# EAGLE design GPRSshield V2 (EAGLE 6.5.0)
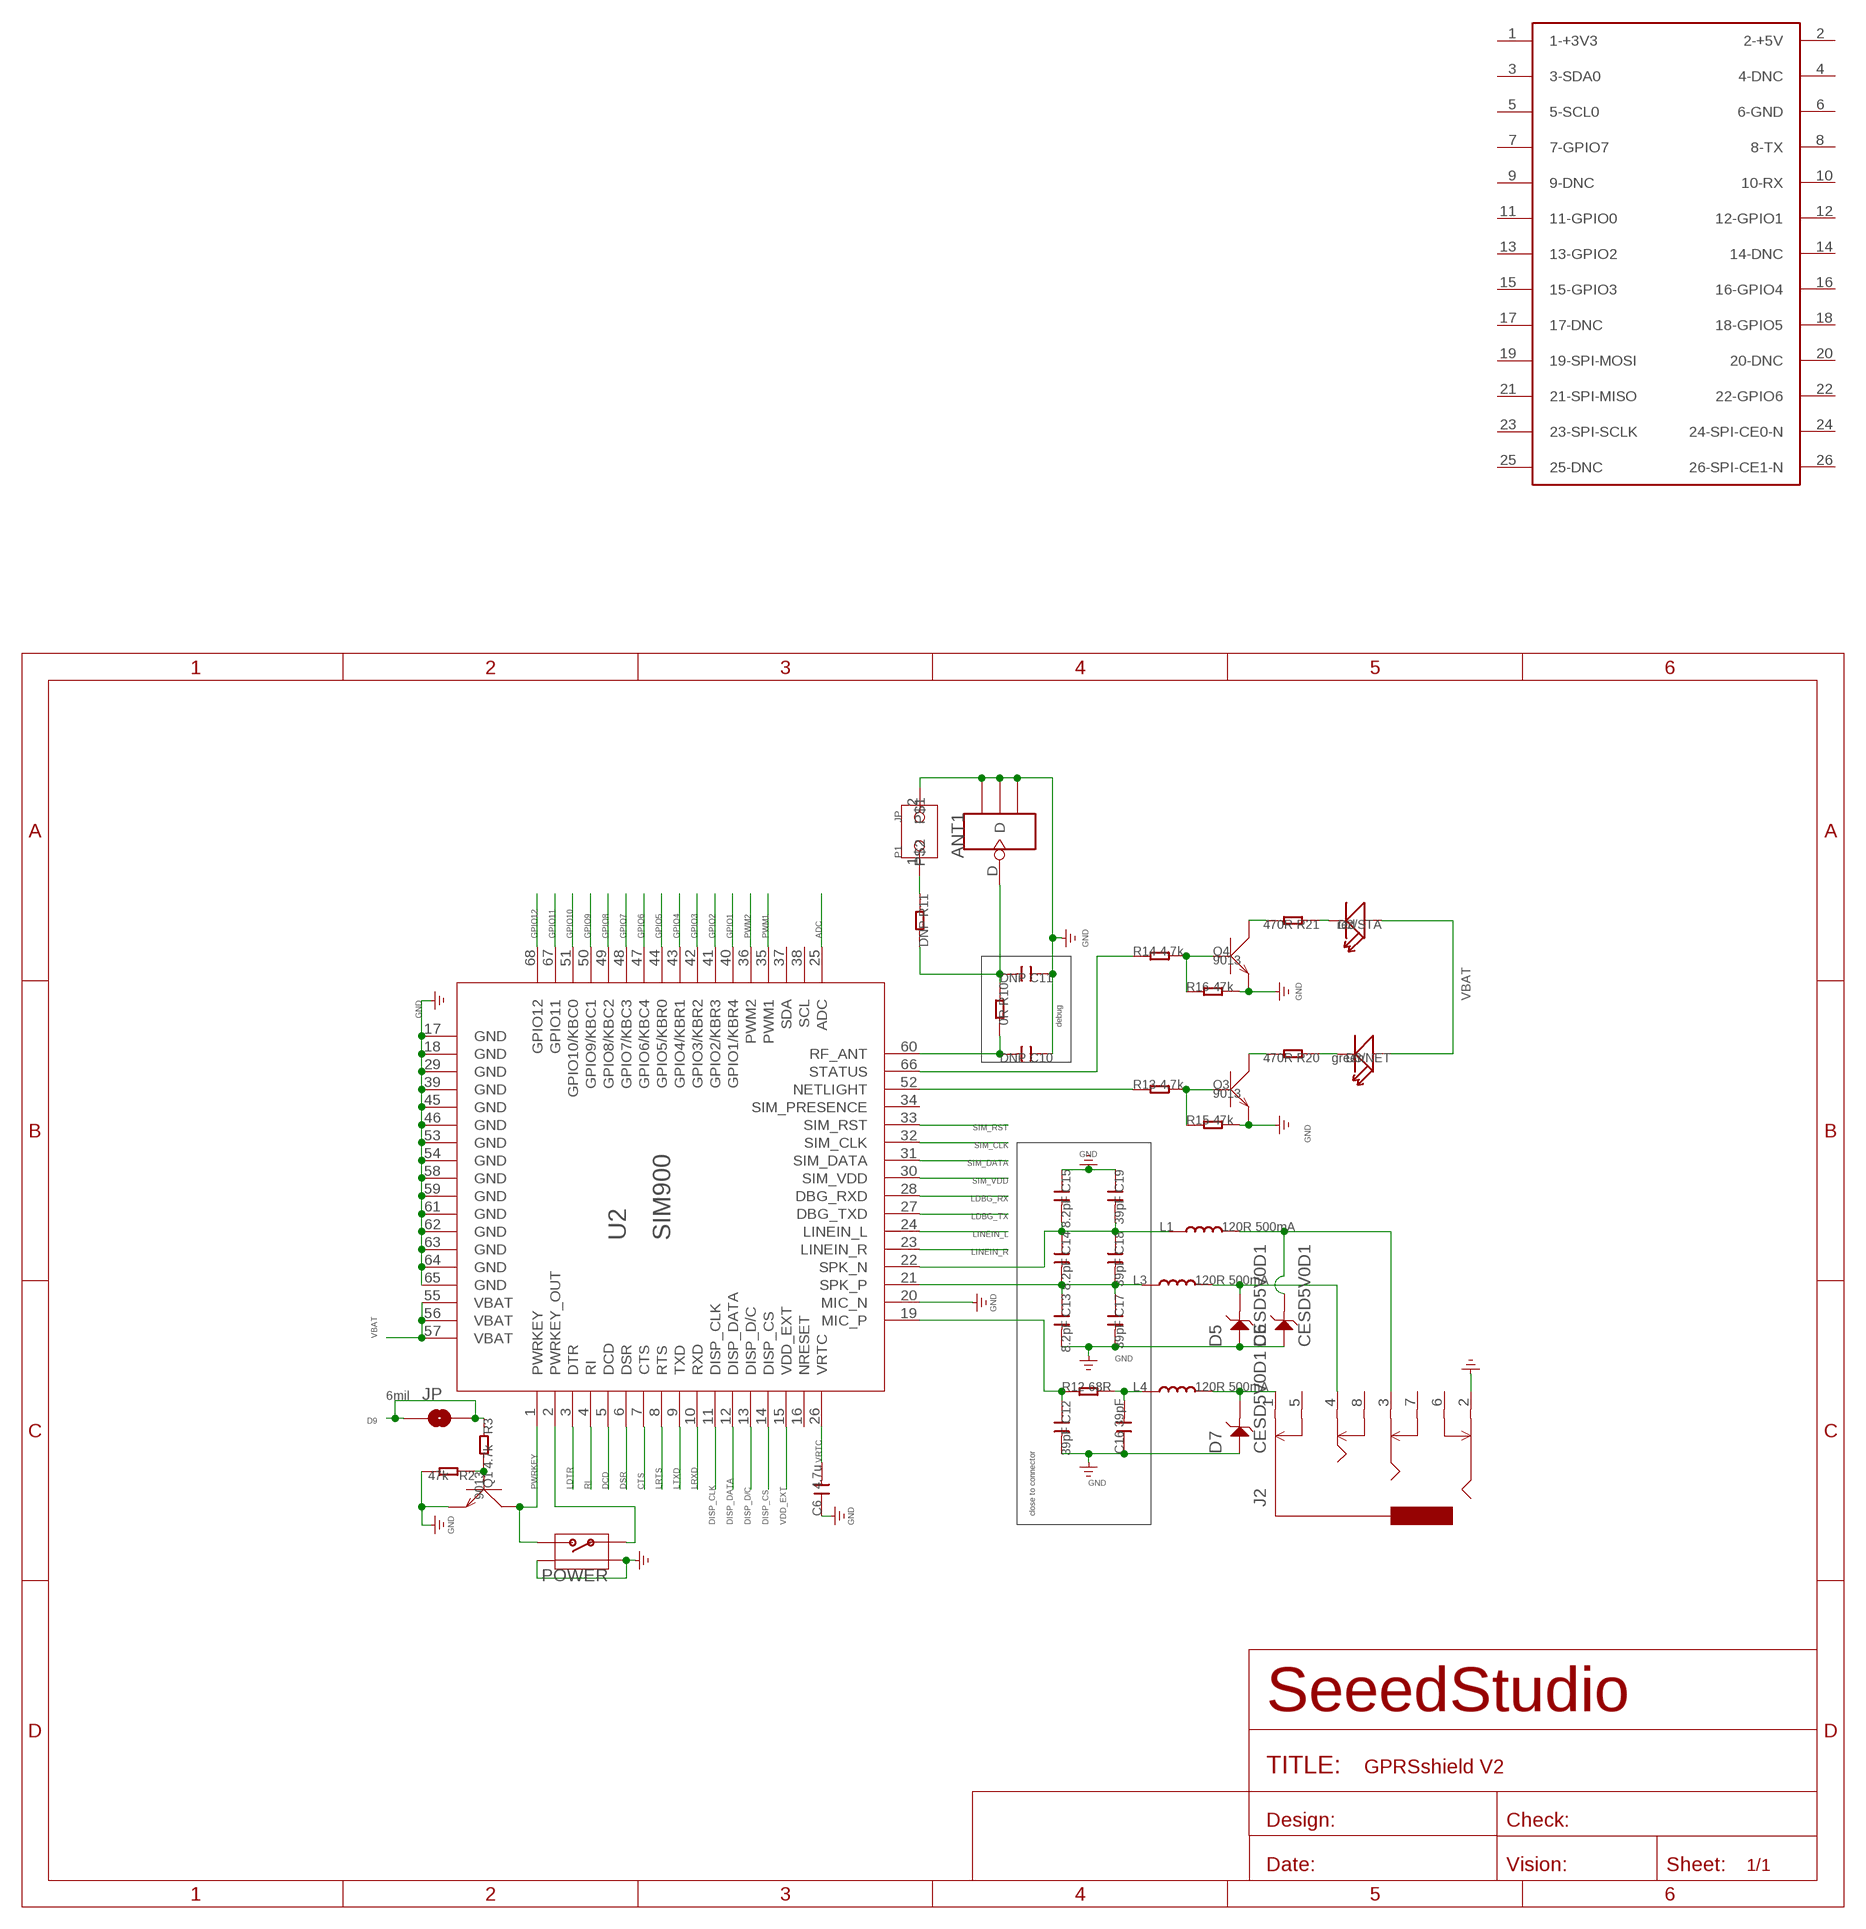
[diagram p0: schematic, sheet 1, part 1 of 2]
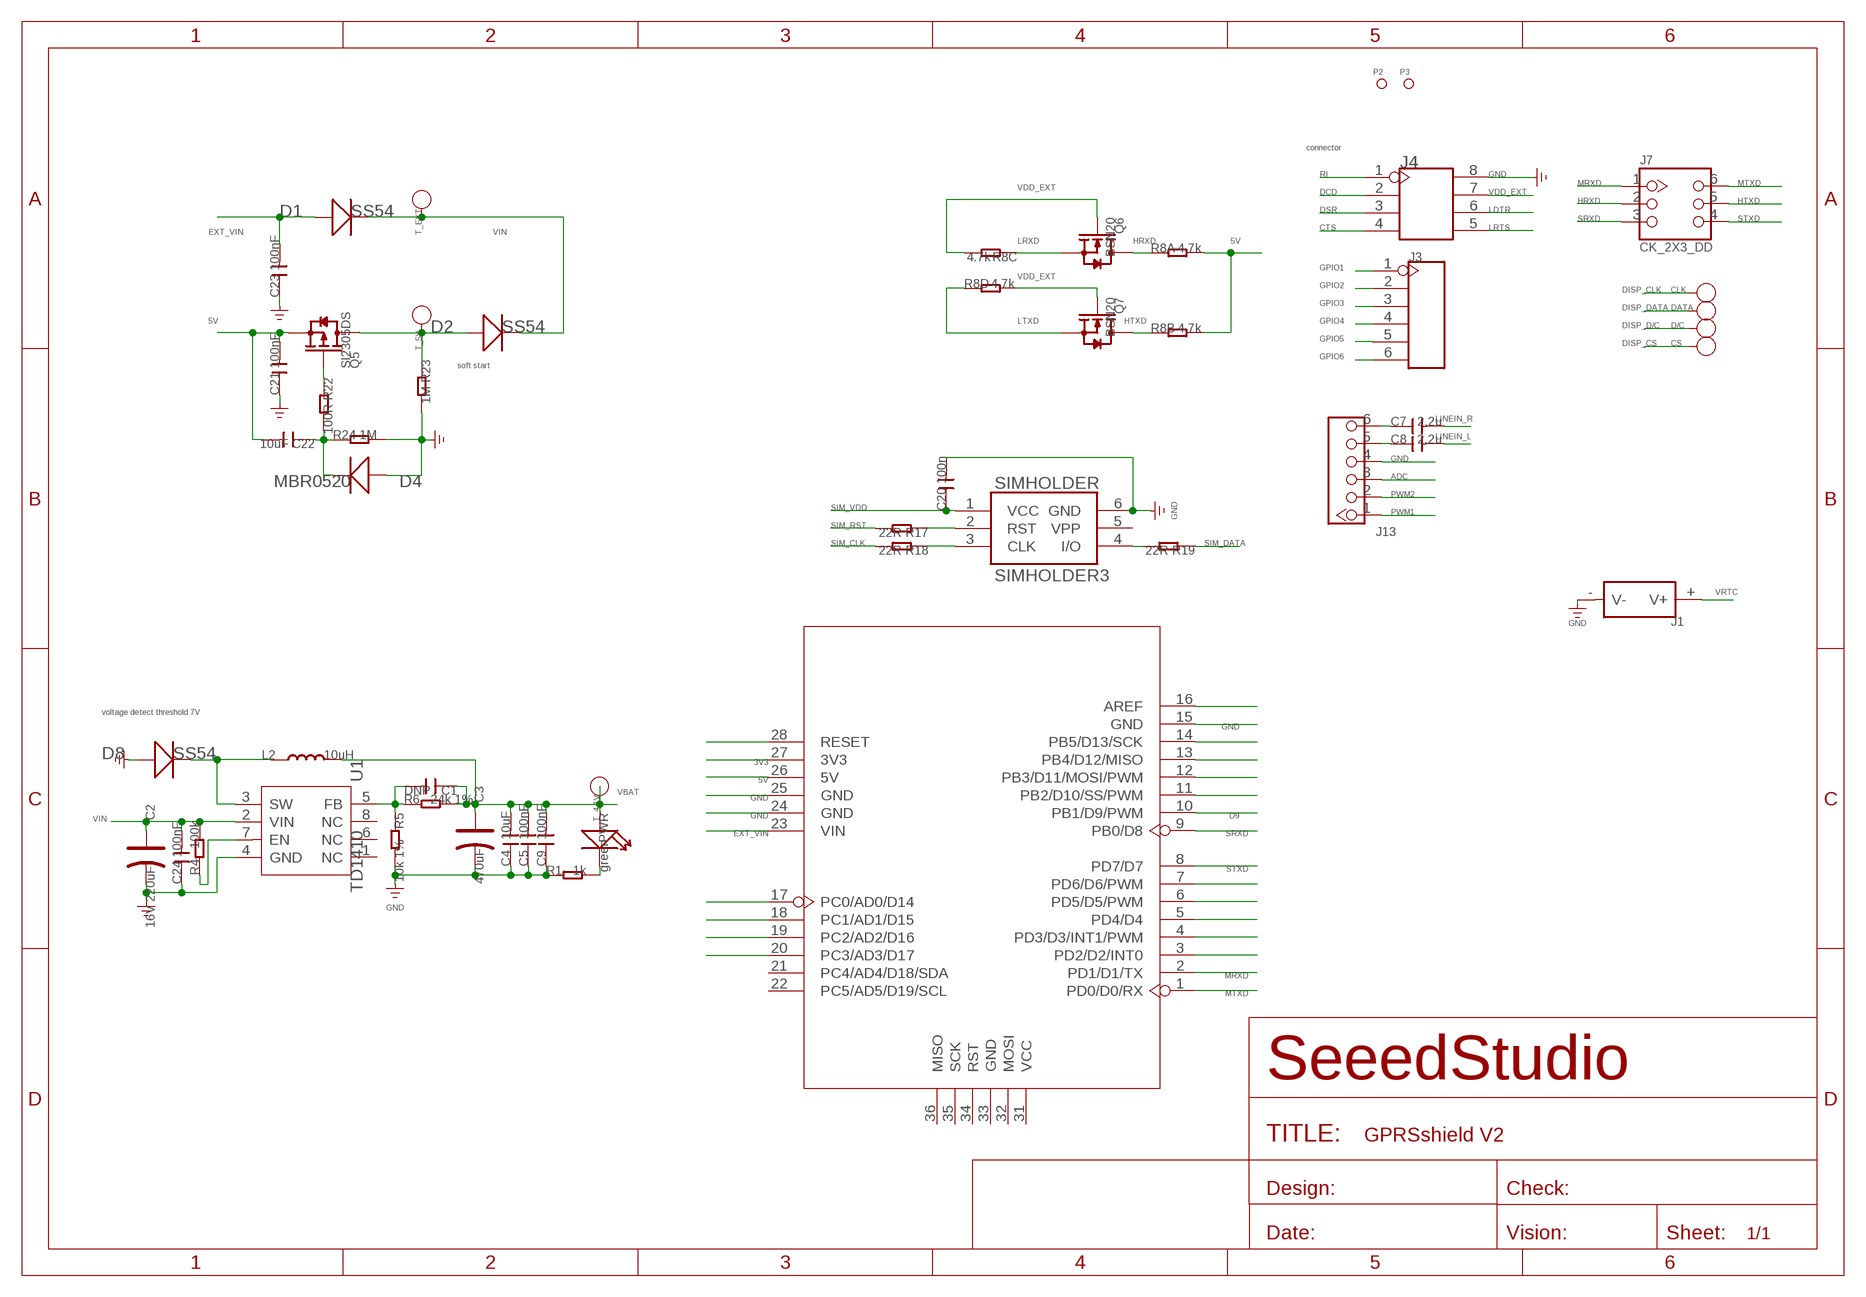
[diagram p1: schematic, sheet 1, part 2 of 2]

## Parts
ANT1  ANTENNA-U-FL  [4P-U-FL]
C1  DNP  C-0603  [C0603]
C2  16V 220uF  CAP-ELECTRO-D  [ELECTRO-SMD-D-5.6MM]
C3  470uF  CAP-AVX-D  [AVX-D]
C4  10uF  C-0805  [C0805]
C5  100nF  C-0603  [C0603]
C6  4.7u  C-0805  [C0805]
C7  2.2u  C-0805  [C0805]
C8  2.2u  C-0805  [C0805]
C9  100nF  C-0603  [C0603]
C10  DNP  C-0603  [C0603]
C11  DNP  C-0603  [C0603]
C12  39pF  C-0603  [C0603]
C13  8.2pF  C-0603  [C0603]
C14  8.2pF  C-0603  [C0603]
C15  8.2pF  C-0603  [C0603]
C16  39pF  C-0603  [C0603]
C17  39pF  C-0603  [C0603]
C18  39pF  C-0603  [C0603]
C19  39pF  C-0603  [C0603]
C20  100n  C-0603  [C0603]
C21  100nF  C-0603  [C0603]
C22  10uF  C-0805  [C0805]
C23  100nF  C-0603  [C0603]
C24  100nF  C-0603  [C0603]
CLK  PAD-TEST-POINT-CIRCLE'4545'  [TP_4545]
CS  PAD-TEST-POINT-CIRCLE'4545'  [TP_4545]
D1  SS54  D'MBRS240LT3'  [SMB]
D2  SS54  D'MBRS240LT3'  [SMB]
D2/STA  red  LED'0603'  [LED-0603]
D3/NET  green  LED'0603'  [LED-0603]
D4  MBR0520  D'MBR0520LT1'  [SOD123-2.7X1.6]
D5  CESD5V0D1  D-ESD  [SOD123-2.7X1.6]
D6  CESD5V0D1  D-ESD  [SOD123-2.7X1.6]
D7  CESD5V0D1  D-ESD  [SOD123-2.7X1.6]
D8  SS54  D'MBRS240LT3'  [SMB]
D/C  PAD-TEST-POINT-CIRCLE'4545'  [TP_4545]
DATA  PAD-TEST-POINT-CIRCLE'4545'  [TP_4545]
J1  HOLDER-BAT  [SMD-CR1220-2]
J2  AUDIO-8P'PJ-3536-L6S'  [8P-3.5-SMD]
J3  HEADER-6P-65/35MIL  [6P-2.54-65/35MIL]
J4  HEADER-2X4P-2.54  [2X4P-2.54]
J7  CK_2X3_DD  [CK_2X3]
J13  HEADER_1X6  [CK_1X6]
JP  PAD-SOLDERJUMPERNC  [2P-SMD-3.3X2]
L1  120R 500mA  L'0603'  [L0603]
L2  10uH  L'0630'  [L0630]
L3  120R 500mA  L'0603'  [L0603]
L4  120R 500mA  L'0603'  [L0603]
P1  JP  [JP]
P2  PAD-MARK  [ROUND-MARK-1.0]
P3  PAD-MARK  [ROUND-MARK-1.0]
POWER  BUTTON-4P-REINFORCE'TS-118E'  [4P-SMD-7X3.5X3.5H]
PWR  green  007-LED0603  [D0603]
Q1  9013  TRANSISTOR-NPN-SOT23  [SOT23]
Q3  9013  TRANSISTOR-NPN-SOT23  [SOT23]
Q4  9013  TRANSISTOR-NPN-SOT23  [SOT23]
Q5  SI2305DS  MOSFET-P'SI2323CDS/SI2305DS<BR>'  [SOT23]
Q6  BSN20  MOSFET-N'SOT23'  [SOT23]
Q7  BSN20  MOSFET-N'SOT23'  [SOT23]
R1  1k  R-0603  [R0603]
R2  47k  R-0603  [R0603]
R3  4.7k  R-0603  [R0603]
R4  100k  R-0603  [R0603]
R5  10k 1%  R-0603  [R0603]
R6  24k 1%  R-0603  [R0603]
R8  4.7k  R-4R-1206  [1206-8-3.3X2.4]
R10  0R  R-0603  [R0603]
R11  DNP  R-0603  [R0603]
R12  68R  R-0603  [R0603]
R13  4.7k  R-0603  [R0603]
R14  4.7k  R-0603  [R0603]
R15  47k  R-0603  [R0603]
R16  47k  R-0603  [R0603]
R17  22R  R-0603  [R0603]
R18  22R  R-0603  [R0603]
R19  22R  R-0603  [R0603]
R20  470R  R-0603  [R0603]
R21  470R  R-0603  [R0603]
R22  100R  R-0603  [R0603]
R23  1M  R-0603  [R0603]
R24  1M  R-0603  [R0603]
SIMHOLDER  SIMHOLDER3  [SIMHOLDER3]
T_4.1V  PAD-TEST-POINT-CIRCLE'4545'  [TP_4545]
T_5V  PAD-TEST-POINT-CIRCLE'4545'  [TP_4545]
T_EXT  PAD-TEST-POINT-CIRCLE'4545'  [TP_4545]
U1  TD1410  [SOP8]
U2  SIM900  [SIM900]
U3  ARDUINO'W/O-SILK'  [ARDUINO-W/O-SILK]
U$4  RASPBERRY-PI  [RASPBERRY-PI]

## Nets
3V3: U3.27(3V3)
5V: C21.2 C22.2 Q5.2(S) R8.7 R8.8 U3.26(5V)
ADC: J13.3 U2.25(ADC)
CTS: J4.4 U2.7(CTS)
D9: JP.1 JP.2 R3.1 U3.10(PB1/D9/PWM)
DCD: J4.2 U2.5(DCD)
DISP_CLK: CLK.T U2.11(DISP_CLK)
DISP_CS: CS.T U2.14(DISP_CS)
DISP_D/C: D/C.T U2.13(DISP_D/C)
DISP_DATA: DATA.T U2.12(DISP_DATA)
DSR: J4.3 U2.6(DSR)
EXT_VIN: C23.2 D1.+ U3.23(VIN)
GND: ANT1.GND1 ANT1.GND2 ANT1.GND3 C2.- C3.- C4.1 C5.1 C6.1 C9.1 C10.1 C11.1 C12.2 C13.2 C15.1 C16.1 C17.2 C19.1 C20.2 C21.1 C23.1 C24.1 D4.1(+) D5.1 D6.1 D7.1 D8.+ J1.-(V-) J2.2 J4.8 J13.4 P1.2 POWER.S1 POWER.S2 Q1.2(E) Q3.2(E) Q4.2(E) R1.1 R2.2 R5.2 R15.2 R16.2 R23.2 R24.2 SIMHOLDER.6(GND) U1.4(GND) U2.17(GND) U2.18(GND) U2.20(MIC_N) U2.29(GND) U2.39(GND) U2.45(GND) U2.46(GND) U2.53(GND) U2.54(GND) U2.58(GND) U2.59(GND) U2.61(GND) U2.62(GND) U2.63(GND) U2.64(GND) U2.65(GND) U3.15(GND) U3.24(GND) U3.25(GND)
GPIO1: J3.1 U2.40(GPIO1/KBR4)
GPIO2: J3.2 U2.41(GPIO2/KBR3)
GPIO3: J3.3 U2.42(GPIO3/KBR2)
GPIO4: J3.4 U2.43(GPIO4/KBR1)
GPIO5: J3.5 U2.44(GPIO5/KBR0)
GPIO6: J3.6 U2.47(GPIO6/KBC4)
GPIO7: U2.48(GPIO7/KBC3)
GPIO8: U2.49(GPIO8/KBC2)
GPIO9: U2.50(GPIO9/KBC1)
GPIO10: U2.51(GPIO10/KBC0)
GPIO11: U2.67(GPIO11)
GPIO12: U2.68(GPIO12)
HRXD: J7.2 Q6.3(D) R8.1
HTXD: J7.5 Q7.3(D) R8.2
LDBG_RX: U2.28(DBG_RXD)
LDBG_TX: U2.27(DBG_TXD)
LDTR: J4.6 U2.3(DTR)
LINEIN_L: C8.2 U2.24(LINEIN_L)
LINEIN_R: C7.2 U2.23(LINEIN_R)
LRTS: J4.5 U2.8(RTS)
LRXD: Q6.2(S) R8.3 U2.10(RXD)
LTXD: Q7.2(S) R8.4 U2.9(TXD)
MRXD: J7.1 U3.2(PD1/D1/TX)
MTXD: J7.6 U3.1(PD0/D0/RX)
N$1: C10.2 R10.2 U2.60(RF_ANT)
N$2: D2.+ Q5.3(D) R23.1 T_5V.T
N$3: Q3.3(C) R20.2
N$4: R19.2 SIMHOLDER.4(I/O)
N$5: R18.1 SIMHOLDER.3(CLK)
N$6: R17.1 SIMHOLDER.2(RST)
N$7: D3/NET.- R20.1
N$8: Q3.1(B) R13.2 R15.1
N$9: PWR.- R1.2
N$10: R13.1 U2.52(NETLIGHT)
N$11: POWER.1 U2.2(PWRKEY_OUT)
N$12: R4.1 U1.7(EN)
N$13: C12.1 R12.1 U2.19(MIC_P)
N$15: C13.1 C14.2 C17.1 C18.2 L3.1 U2.21(SPK_P)
N$16: Q4.3(C) R21.2
N$17: D2/STA.- R21.1
N$18: Q4.1(B) R14.2 R16.1
N$19: C14.1 C15.2 C18.1 C19.2 L1.1 U2.22(SPK_N)
N$20: R14.1 U2.66(STATUS)
N$21: ANT1.D C11.2 R10.1 R11.2
N$23: C7.1 J13.6
N$24: U3.3(PD2/D2/INT0)
N$25: U3.4(PD3/D3/INT1/PWM)
N$26: U3.5(PD4/D4)
N$27: U3.6(PD5/D5/PWM)
N$28: U3.7(PD6/D6/PWM)
N$29: C8.1 J13.5
N$30: C16.2 L4.1 R12.2
N$31: Q5.1(G) R22.1
N$32: U3.11(PB2/D10/SS/PWM)
N$33: U3.12(PB3/D11/MOSI/PWM)
N$34: U3.13(PB4/D12/MISO)
N$35: U3.14(PB5/D13/SCK)
N$36: Q1.1(B) R2.1 R3.2
N$37: U3.16(AREF)
N$38: D8.- L2.1 U1.3(SW)
N$39: C22.1 D4.2(-) R22.2 R24.1
N$41: U3.20(PC3/AD3/D17)
N$42: U3.19(PC2/AD2/D16)
N$43: U3.18(PC1/AD1/D15)
N$44: U3.17(PC0/AD0/D14)
N$45: D7.2 J2.1 L4.2
N$47: C1.2 R5.1 R6.1 U1.5(FB)
N$48: D5.2 J2.4 L3.2
N$50: U3.28(RESET)
N$51: D6.2 J2.3 L1.2
N$52: P1.1 R11.1
PWM1: J13.1 U2.35(PWM1)
PWM2: J13.2 U2.36(PWM2)
PWRKEY: POWER.2 Q1.3(C) U2.1(PWRKEY)
RI: J4.1 U2.4(RI)
SIM_CLK: R18.2 U2.32(SIM_CLK)
SIM_DATA: R19.1 U2.31(SIM_DATA)
SIM_RST: R17.2 U2.33(SIM_RST)
SIM_VDD: C20.1 SIMHOLDER.1(VCC) U2.30(SIM_VDD)
SRXD: J7.3 U3.9(PB0/D8)
STXD: J7.4 U3.8(PD7/D7)
VBAT: C1.1 C3.+ C4.2 C5.2 C9.2 D2/STA.+ D3/NET.+ L2.2 PWR.+ R6.2 T_4.1V.T U2.55(VBAT) U2.56(VBAT) U2.57(VBAT)
VDD_EXT: J4.7 Q6.1(G) Q7.1(G) R8.5 R8.6 U2.15(VDD_EXT)
VIN: C2.+ C24.2 D1.- D2.- R4.2 T_EXT.T U1.2(VIN)
VRTC: C6.2 J1.+(V+) U2.26(VRTC)
Unconnected: J2.5 J2.6 J2.7 J2.8 SIMHOLDER.5(VPP) U1.1(NC) U1.6(NC) U1.8(NC) U2.16(NRESET) U2.34(SIM_PRESENCE) U2.37(SDA) U2.38(SCL) U3.21(PC4/AD4/D18/SDA) U3.22(PC5/AD5/D19/SCL) U3.31(VCC) U3.32(MOSI) U3.33(GND) U3.34(RST) U3.35(SCK) U3.36(MISO) U$4.1(1-+3V3) U$4.2(2-+5V) U$4.3(3-SDA0) U$4.4(4-DNC) U$4.5(5-SCL0) U$4.6(6-GND) U$4.7(7-GPIO7) U$4.8(8-TX) U$4.9(9-DNC) U$4.10(10-RX) U$4.11(11-GPIO0) U$4.12(12-GPIO1) U$4.13(13-GPIO2) U$4.14(14-DNC) U$4.15(15-GPIO3) U$4.16(16-GPIO4) U$4.17(17-DNC) U$4.18(18-GPIO5) U$4.19(19-SPI-MOSI) U$4.20(20-DNC) U$4.21(21-SPI-MISO) U$4.22(22-GPIO6) U$4.23(23-SPI-SCLK) U$4.24(24-SPI-CE0-N) U$4.25(25-DNC) U$4.26(26-SPI-CE1-N)

## Notes on the sheet
- connector
- soft start
- debug
- voltage detect threshold 7V
- 6mil
- close to connector

## Library data of the parts
ANT1 = Connector:ANTENNA-U-FL
C1 C4-C24 = Discrete:C*: Ceramic Capacitors
C2 C3 = Discrete:CAP*: Electrolytic Capacitors,Tantalum Capacitors and Super Capacitors
CLK CS D/C DATA T_4.1V T_5V T_EXT = Discrete:PAD-TEST-POINT-CIRCLE; PARTNO: DNP
D1 D2 D4 D8 = Discrete:D*
D2/STA D3/NET = Discrete:LED*
D5-D7 = template:D-ESD: Diodes for Protectiong against ESD
J1 = Connector:HOLDER-BAT: button cell holder
J2 = template:AUDIO-8P
J3 = Connector:HEADER-6P
J4 = Connector:HEADER-2X4P
J7 = CONNECTER:CK_2X3
J13 = CONNECTER:HEADER_1X6
JP = Discrete:PAD-SOLDERJUMPER: Solder Jumper Standard SMD solder jumper. Used to automate production. Two varients : Normally Open and Normally Closed are the same, but have different paste layers. NC will have a large amount of paste and should jumper during reflow.
L1-L4 = Discrete:L*
P1 = mySeeed:JP
P2 P3 = Discrete:PAD-MARK; PARTNO: DNP
POWER = Discrete:BUTTON-4P-REINFORCE: TS-1188E http://www.best-dz.com/?thread-374-2.html
PWR = Discrete:007-LED*
Q1 Q3 Q4 = Discrete:TRANSISTOR-NPN*: NPN audion
Q5 = Discrete:MOSFET-P
Q6 Q7 = Discrete:MOSFET-N: IRLL014: http://www.vishay.com/docs/91319/sihll014.pdf
R1-R6 R10-R24 = Discrete:R*
R8 = Discrete:R-4R*: Resistor Array
SIMHOLDER = SparkFun2:SIMHOLDER3
U1 = template:TD1410: 2A 380KHz 20V PWM Buck DC/DC Converter
U2 = ICs_v54:SIM900
U3 = moudle:ARDUINO
U$4 = RaspberryPi:RASPBERRY-PI: Raspberry Pi Board <http://www.raspberrypi.org/> Jacques Lagnel V1.0 (beta) 2012 Board dimension: Forum 3D model <http://www.raspberrypi.org/forum/general-discussion/mechanical-profile-3d-models?value=3d%20model&type=1&include=1&search=1&ret=all> The GPIO Connector (P1): http://elinux.org/RPi_Low-level_peripherals

## Net classes
0 default: clearance 0.152 mm

## Board
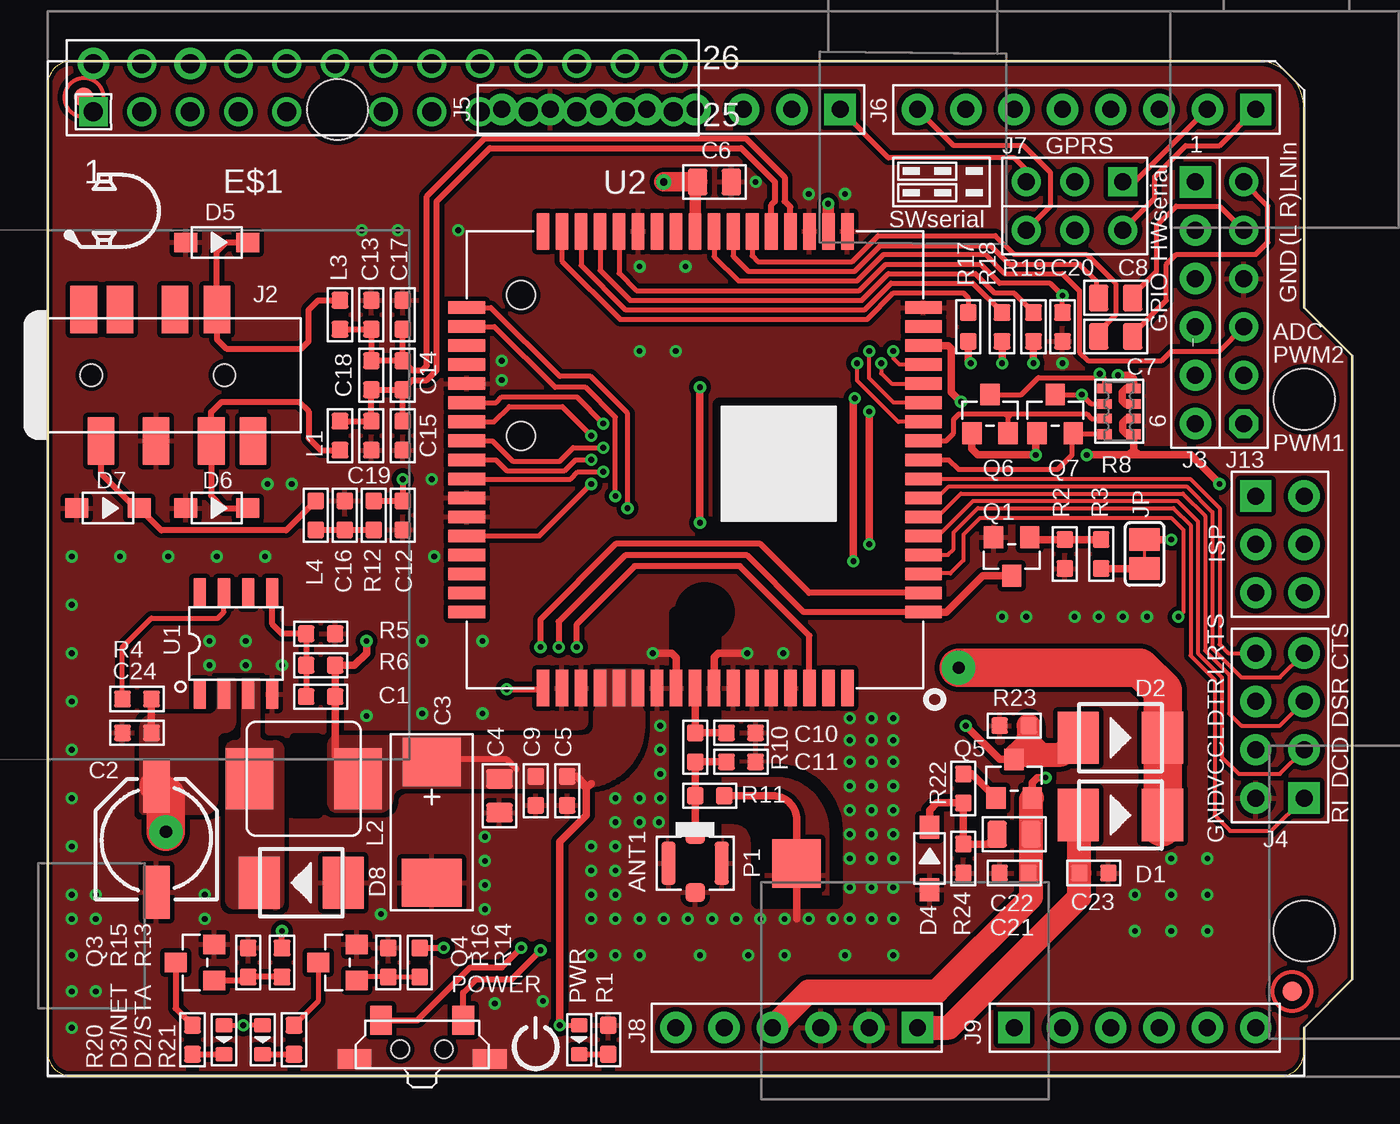
[diagram p2: board, top side]
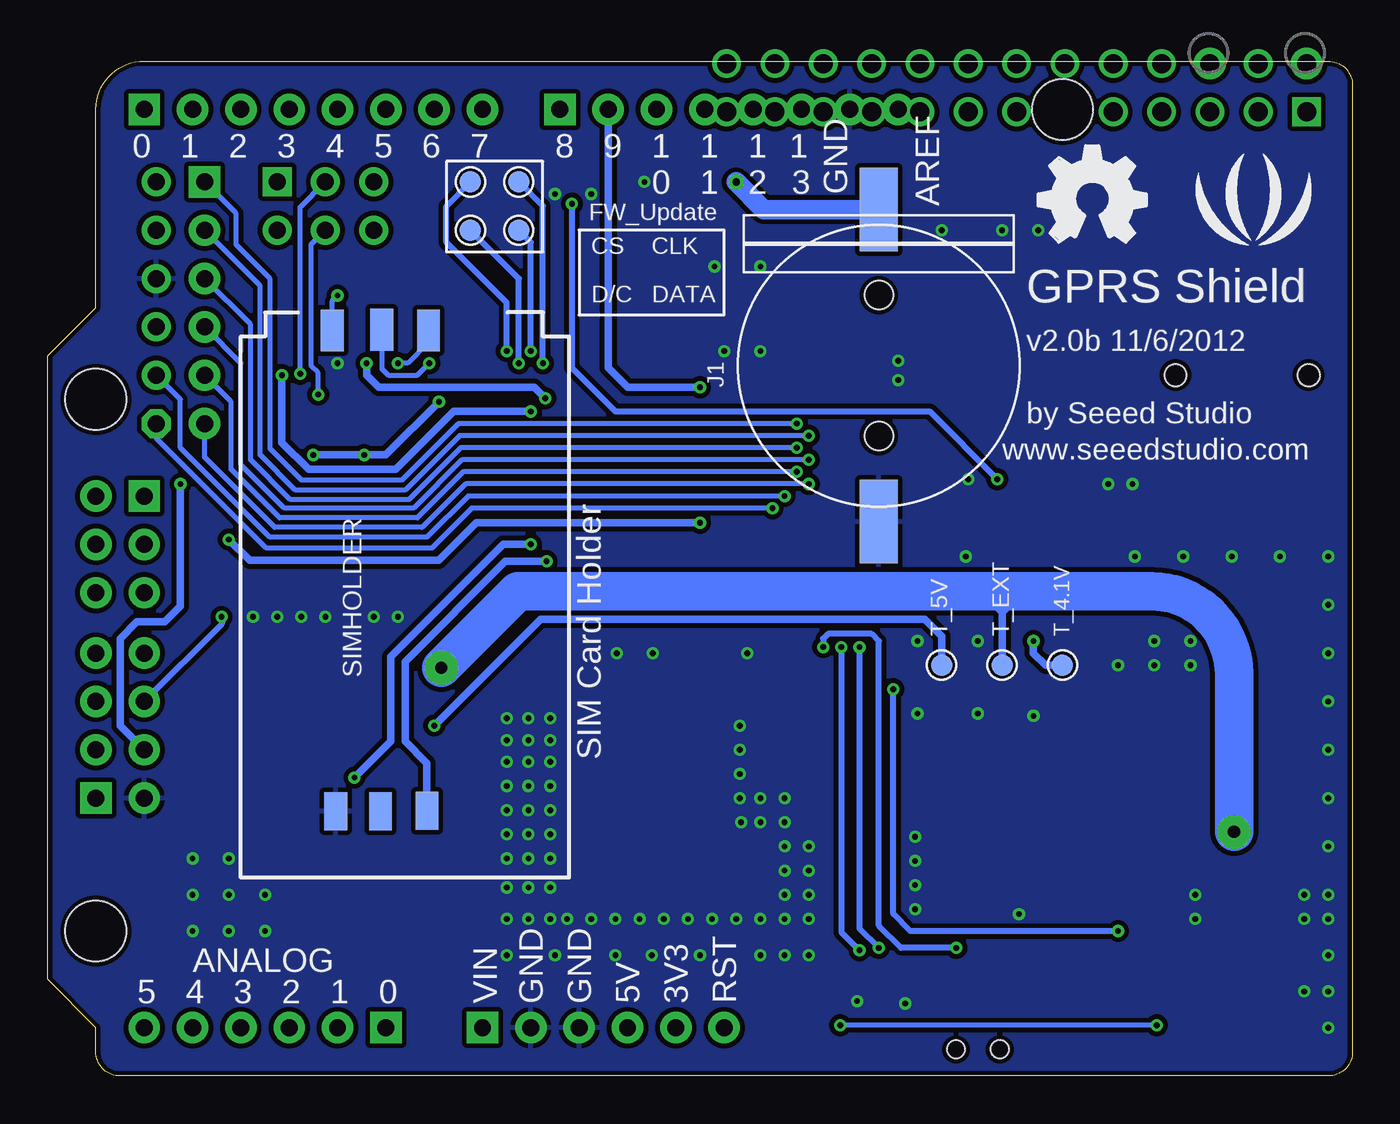
[diagram p3: board, bottom side, seen from below]

Size 68.58 x 53.34 mm. Coordinates in mm from the lower left corner, seen from the top.
Outline: 66.04,40.39 66.04,50.8 arc90 63.5,53.34 1.27,53.34 arc90 0,52.07 0,1.27 arc90 1.27,0 64.77,0 arc90 66.04,1.27 66.04,2.54 68.58,5.08 68.58,37.85 66.04,40.39
Copper layers (1*16): Top 0.035mm / dielectric 1.5mm / Bottom 0.035mm
Design rules "default *": minimum track width 6mil, minimum drill 12mil, track to track 6mil, track to pad 6mil, pad to pad 6mil, via to via 6mil, smd to smd 0mil, copper to edge 10mil, drill to drill 10mil, minimum pad ring 10mil, minimum via ring 6mil, stop-mask expansion 2mil, vias tented up to drill 100mil, thermal gap 10mil
tRestrict: area -14,-47.5 to -13.7,-47.4; area 13,13.8 to 14.2,17.8; area 36.4,20.1 to 36.6,20.8; area 37.5,20 to 37.6,20.8; area 38.5,20.1 to 38.6,20.8; area 27.5,19.9 to 27.6,20.7; area 21.7,29.8 to 22.4,30; 15 lines

### Footprints (pad centres in the part's own frame; a part is rotated, then mirrored left to right if it is on the bottom)
4P-U-FL = smd 1.016 x 1.016: D -1.524,0; GND3 1.524,0 | smd 2.286 x 0.762: GND1 0,1.397; GND2 0,-1.397
C0603 = smd 0.889 x 0.889: 1 -0.762,0; 2 0.762,0
ELECTRO-SMD-D-5.6MM = smd 2.794 x 1.397: + 2.794,0; - -2.794,0
AVX-D = smd 2.54 x 3.048: + -3.175,0 | smd 2.54 x 3.175: - 3.175,0
C0805 = smd 1.016 x 1.397: 1 -0.889,0; 2 0.889,0
TP_4545 = smd 1.143 x 1.143: T 0,0
SMB = smd 2.159 x 2.743: + -2.21,0; - 2.21,0
D0603 = smd 0.762 x 0.889: + -0.762,0; - 0.762,0
SOD123-2.7X1.6 = smd 1.2 x 1.02: 1 -1.635,0; 2 1.635,0
RASPBERRY-PI = drill 1 square: 1 0,0 | drill 1 pad 1.676: 2 0,2.54; 6 5.08,2.54 | drill 1: 3 2.54,0; 4 2.54,2.54; 5 5.08,0; 7 7.62,0; 8 7.62,2.54; 9 10.16,0; 10 10.16,2.54; 11 12.7,0; 12 12.7,2.54; 13 15.24,0; 14 15.24,2.54; 15 17.78,0; 16 17.78,2.54; 17 20.32,0; 18 20.32,2.54; 19 22.86,0; 20 22.86,2.54; 21 25.4,0; 22 25.4,2.54; 23 27.94,0; 24 27.94,2.54; 25 30.48,0; 26 30.48,2.54
SMD-CR1220-2 = smd 2 x 4.4: + 0,-8.2; - 0,8.2 | hole 1.5: 0,3.7; 0,-3.7
8P-3.5-SMD = smd 1.4 x 2.5: 1 2.8,-3.45; 2 5.7,-3.45; 3 8.6,-3.45; 4 8.9,3.45; 5 1.9,3.45; 6 3.8,3.45; 7 6.7,3.45; 8 10.8,-3.45 | hole 1.149: 2.3,0; 9.3,0
6P-2.54-65/35MIL = drill 0.889 pad 1.651 square: 1 0,6.35 | drill 0.889 pad 1.651: 2 0,3.81; 3 0,1.27; 4 0,-1.27; 5 0,-3.81; 6 0,-6.35
2X4P-2.54 = drill 0.889 pad 1.651 square: 1 -1.27,3.81 | drill 0.889 pad 1.651: 2 -1.27,1.27; 3 -1.27,-1.27; 4 -1.27,-3.81; 5 1.27,-3.81; 6 1.27,-1.27; 7 1.27,1.27; 8 1.27,3.81
CK_2X3 = drill 0.889 pad 1.524 square: 1 -1.27,2.54 | drill 0.889 pad 1.524: 2 -1.27,0; 3 -1.27,-2.54; 4 1.27,-2.54; 5 1.27,0; 6 1.27,2.54
CK_1X6 = drill 0.889 pad 1.524 octagon: 1 0,6.35 | drill 0.889 pad 1.524: 2 0,3.81; 3 0,1.27; 4 0,-1.27; 5 0,-3.81; 6 0,-6.35
2P-SMD-3.3X2 = smd 1.168 x 1.6: 1 -0.762,0; 2 0.762,0
L0603 = smd 0.889 x 0.889: 1 -0.762,0; 2 0.762,0
L0630 = smd 2.5 x 3.2: 1 -2.85,0; 2 2.85,0
JP = smd 1.27 x 2.54: 1 -0.635,0; 2 0.635,0
ROUND-MARK-1.0 = smd 1.016 x 1.016: P$1 0,0
4P-SMD-7X3.5X3.5H = smd 1.143 x 1.524: 1 -2.159,1.524; 2 2.159,1.524 | smd 1.778 x 1.016: S1 -3.556,-0.508; S2 3.556,-0.508 | hole 0.95: -1.15,0; 1.15,0
SOT23 = smd 1.016 x 1.143: 1 -0.95,-1.016; 2 0.95,-1.016; 3 0,1.016
R0603 = smd 0.889 x 0.889: 1 -0.762,0; 2 0.762,0
1206-8-3.3X2.4 = smd 0.508 x 0.762: 1 -1.206,-0.762; 2 -0.381,-0.762; 3 0.381,-0.762; 4 1.206,-0.762; 5 1.206,0.762; 6 0.381,0.762; 7 -0.381,0.762; 8 -1.206,0.762
SIMHOLDER3 = smd 2.2 x 1.2: 1 0.95,4.81; 2 0.91,7.41; 3 0.95,9.86 | smd 2 x 1.2: 4 26.2,9.78; 5 26.22,7.34; 6 26.22,4.98
SOP8 = smd 0.635 x 1.524: 1 -1.905,-2.667; 2 -0.635,-2.667; 3 0.635,-2.667; 4 1.905,-2.667; 5 1.905,2.667; 6 0.635,2.667; 7 -0.635,2.667; 8 -1.905,2.667
SIM900 = smd 1.93 x 0.66: 1 -12,8; 2 -12,7; 3 -12,6; 4 -12,5; 5 -12,4; 6 -12,3; 7 -12,2; 8 -12,1; 9 -12,0; 10 -12,-1; 11 -12,-2; 12 -12,-3; 13 -12,-4; 14 -12,-5; 15 -12,-6; 16 -12,-7; 17 -12,-8; 35 12,-8; 36 12,-7; 37 12,-6; 38 12,-5; 39 12,-4; 40 12,-3; 41 12,-2; 42 12,-1; 43 12,0; 44 12,1; 45 12,2; 46 12,3; 47 12,4; 48 12,5; 49 12,6; 50 12,7; 51 12,8 | smd 0.66 x 1.93: 18 -8,-12; 19 -7,-12; 20 -6,-12; 21 -5,-12; 22 -4,-12; 23 -3,-12; 24 -2,-12; 25 -1,-12; 26 0,-12; 27 1,-12; 28 2,-12; 29 3,-12; 30 4,-12; 31 5,-12; 32 6,-12; 33 7,-12; 34 8,-12; 52 8,12; 53 7,12; 54 6,12; 55 5,12; 56 4,12; 57 3,12; 58 2,12; 59 1,12; 60 0,12; 61 -1,12; 62 -2,12; 63 -3,12; 64 -4,12; 65 -5,12; 66 -6,12; 67 -7,12; 68 -8,12
ARDUINO-W/O-SILK = drill 0.889 pad 1.651 square: 1 63.5,50.8; 9 41.656,50.8; 17 50.8,2.54; 23 45.72,2.54; 36 63.5,30.48 | drill 0.889 pad 1.651: 2 60.96,50.8; 3 58.42,50.8; 4 55.88,50.8; 5 53.34,50.8; 6 50.8,50.8; 7 48.26,50.8; 8 45.72,50.8; 10 39.116,50.8; 11 36.576,50.8; 12 34.036,50.8; 13 31.496,50.8; 14 28.956,50.8; 15 26.416,50.8; 16 23.876,50.8; 18 53.34,2.54; 19 55.88,2.54; 20 58.42,2.54; 21 60.96,2.54; 22 63.5,2.54; 24 43.18,2.54; 25 40.64,2.54; 26 38.1,2.54; 27 35.56,2.54; 28 33.02,2.54; 31 66.04,30.48; 32 66.04,27.94; 33 66.04,25.4; 34 63.5,25.4; 35 63.5,27.94 | hole 3.2: 15.24,50.8; 66.04,35.56; 66.04,7.62

### Placement (x,y rotation side)
ANT1  34.04,11.18 270 top
C1  14.35,19.94 180 top
C2  5.71,12.45 90 top
C3  20.19,13.34 270 top
C4  23.75,14.73 90 top
C5  27.3,14.99 90 top
C6  35.05,46.99 180 top
C7  56.13,38.86 180 top
C8  56.13,40.89 180 top
C9  25.65,14.99 90 top
C10  36.45,18.03 180 top
C11  36.45,16.51 180 top
C12  18.67,29.46 270 top
C13  17.02,40.01 90 top
C14  18.67,36.83 90 top
C15  18.67,33.66 90 top
C16  15.62,29.46 270 top
C17  18.67,40.01 90 top
C18  17.02,36.83 90 top
C19  17.02,33.66 90 top
C20  53.34,39.37 270 top
C21  50.8,10.67 0 top
C22  50.8,12.7 0 top
C23  54.99,10.67 180 top
C24  4.7,18.03 0 top
CLK  43.81,46.99 270 bottom
CS  46.35,46.99 270 bottom
D1  56.39,13.72 0 top
D2  56.39,17.78 0 top
D2/STA  red  [D0603]  11.3,1.91 270 top
D3/NET  green  [D0603]  9.27,1.91 270 top
D4  46.35,11.43 90 top
D5  8.89,43.81 0 top
D6  8.89,29.84 0 top
D7  3.17,29.84 0 top
D8  13.34,10.16 180 top
D/C  46.35,44.45 270 bottom
DATA  43.81,44.45 270 bottom
E$1  [RASPBERRY-PI]  2.41,50.67 0 top
J1  24.89,37.34 180 bottom
J2  0,36.83 0 top
J3  60.33,40.64 0 top
J4  64.77,18.41 180 top
J7  53.98,45.72 270 top
J13  62.87,40.64 180 top
JP  57.66,27.43 90 top
L1  15.37,33.66 270 top
L2  13.46,15.62 0 top
L3  15.37,40.01 90 top
L4  14.1,29.46 90 top
P1  39.37,11.18 270 top
P2  65.41,4.45 0 top
P3  1.91,51.44 0 top
POWER  19.68,1.4 0 top
PWR  27.94,1.91 270 top
Q1  50.67,27.3 180 top
Q3  7.75,5.97 90 top
Q4  15.24,5.97 90 top
Q5  50.8,15.62 0 top
Q6  49.53,34.8 0 top
Q7  52.96,34.8 0 top
R1  29.46,1.91 270 top
R2  53.47,27.43 270 top
R3  55.37,27.43 90 top
R4  4.7,19.81 0 top
R5  14.35,23.24 0 top
R6  14.35,21.59 0 top
R8  56.32,34.93 270 top
R10  34.04,17.27 90 top
R11  34.8,14.73 180 top
R12  17.14,29.46 270 top
R13  12.32,5.97 270 top
R14  19.56,5.97 270 top
R15  10.54,5.97 90 top
R16  17.91,5.97 90 top
R17  48.39,39.37 90 top
R18  50.16,39.37 90 top
R19  51.82,39.37 270 top
R20  7.62,1.91 90 top
R21  12.95,1.91 90 top
R22  48.13,15.11 270 top
R23  50.8,18.41 180 top
R24  48.13,11.43 270 top
SIMHOLDER  58.42,40.13 270 bottom
T_4.1V  15.24,21.59 270 bottom
T_5V  21.59,21.59 0 bottom
T_EXT  18.41,21.59 0 bottom
U1  9.91,22.73 0 top
U2  34.04,32.38 180 top
U3  0,0 0 top
U$26  [LOGO_SILK]  5.21,45.34 0 bottom
U$28  [OSHW_FILLX200_NOTEXT]  16.51,43.81 0 bottom

### Tracks (layer width: path | path; a pad name or v marks a point on that pad's centre or on a via)
5V  (via drill 0.3 pad 0.64)
  Top 0.406: v56.26,36.83 56.9,36.83 57.08,36.64 R8.8 | R8.8 56.97,36.14 | v43.18,27.94 v43.18,34.92 | R8.8 56.69,36.14 56.49,35.94 56.49,35.5 56.68,35.31 R8.7 | C22.2 51.69,10.79 C21.2 | Q5.2 51.75,15.41 52.02,15.68 v52.45,15.68
  Top 1.27: U3.26 40.01,4.45 46.74,4.45 51.69,9.4 C22.2 51.69,14.54 Q5.2
  Bottom 0.406: v43.18,34.92 47.24,34.92 50.28,31.89 54.86,31.89 56.26,33.29 v56.26,36.83 | v43.18,27.94 44.64,27.94 50.55,22.04 50.55,17.59 v52.45,15.68
ADC
  Top 0.254: U2.25 35.04,43.07 36.32,41.78 42.55,41.78 43.94,43.18 49.28,43.18 50.29,42.16 53.34,42.16 54.23,41.27 54.23,38.05 54.69,37.59 58.55,37.59 59.05,38.1 61.59,38.1 J13.3
CTS
  Top 0.203: J4.4 64.77,20.95 62.74,20.95 61.21,22.48 61.21,29.64 59.86,30.99 47.37,30.99 46.77,30.39 U2.7
D9  (via drill 0.3 pad 0.64)
  Top 0.152: JP.1 JP.2
  Top 0.406: v34.29,29.08 v34.29,36.2 | R3.1 JP.1 | v59.05,28.19 JP.2
  Bottom 0.406: v59.05,28.19 57.96,27.1 48.02,27.1 46.04,29.08 v34.29,29.08 | v34.29,36.2 38.1,36.2 39.12,37.21 U3.10
DCD
  Top 0.203: J4.2 64.77,15.88 62.61,15.88 61.72,16.76 61.72,20.95 60.45,22.23 60.45,29.15 59.37,30.23 48.64,30.23 46.8,28.39 U2.5
DISP_CLK  (via drill 0.3 pad 0.64)
  Top 0.203: U2.11 44.71,34.38 42.55,36.55 v42.55,37.47
  Bottom 0.305: v42.55,37.47 42.55,45.72 CLK.T
DISP_CS  (via drill 0.3 pad 0.64)
  Top 0.203: v44.45,38.1 44.45,37.72 44.78,37.38 U2.14
  Bottom 0.305: v44.45,38.1 44.45,40.64 47.62,43.81 47.62,45.72 CS.T
DISP_D/C  (via drill 0.3 pad 0.64)
  Top 0.203: v43.81,37.47 43.81,36.93 44.36,36.39 U2.13
  Bottom 0.305: v43.81,37.47 43.81,41.91 D/C.T
DISP_DATA  (via drill 0.3 pad 0.64)
  Top 0.203: U2.12 44.47,35.38 43.18,36.68 v43.18,38.1
  Bottom 0.305: v43.18,38.1 43.18,43.81 DATA.T
DSR
  Top 0.203: J4.3 64.77,18.41 62.74,18.41 62.1,19.05 62.1,21.08 60.83,22.35 60.83,29.44 59.66,30.61 48.01,30.61 46.78,29.39 U2.6
EXT_VIN
  Top 1.27: D1.+ 54.23,13.66 C23.2 54.23,9.4 47.37,2.54 U3.23
GND  (via drill 0.3 pad 0.64)
  Top 0.406: P1.2 39.37,8.26 | U2.59 33.04,21.99 32.8,22.23 v31.81,22.23 | U2.61 35.04,22.02 35.24,22.23 v36.77,22.23
  other vias: 53.34,37.47 10.41,22.86 8.51,22.86 8.51,21.59 10.41,21.59 12.32,21.59 22.99,12.57 22.99,11.3 22.99,8.76 22.99,10.03 19.68,22.86 16.76,18.92 19.68,19.05 22.86,19.05 1.27,9.53 42.16,16.51 32.19,18.41 32.19,15.88 32.13,13.34 29.84,13.34 29.84,10.79 29.84,8.26 31.11,8.26 34.92,8.26 36.2,8.26 38.73,8.26 41.27,8.26 42.16,18.8 1.27,8.26 1.27,4.45 2.54,9.53 2.54,4.45 1.27,12.06 1.27,14.61 1.27,17.14 1.27,19.68 1.27,22.23 1.27,24.77 1.27,27.3 3.81,27.3 6.35,27.3 8.89,27.3 11.43,27.3 11.56,31.11 2.54,8.26 22.86,22.86 38.67,22.23 8.26,9.53 8.26,8.26 17.53,8.51 20.19,31.37 20.32,27.3 23.88,37.59 23.88,36.58 12.83,31.11 16.51,44.45 18.41,44.45 21.59,44.45 31.11,42.55 33.53,42.55 37.21,46.99 31.11,38.1 33.02,38.1 40.01,46.35 41.91,46.35 28.57,10.79 28.57,8.26 28.57,6.35 29.84,6.35 31.11,6.35 32.38,8.26 33.66,8.26 34.29,6.35 36.83,6.35 38.73,6.35 37.47,8.26 43.31,8.26 42.16,13.97 42.16,11.43 32.19,17.14 32.19,14.61 28.57,12.06 29.84,12.06 28.57,9.53 29.84,9.53 42.16,9.91 43.31,9.91 43.31,11.43 42.16,12.7 43.31,12.7 43.31,13.97 42.16,15.24 43.31,15.24 43.31,16.51 42.16,17.65 43.31,17.65 43.31,18.8 31.11,13.34 31.11,14.61 29.84,14.61 40.01,8.26 42.16,8.26 53.98,24.13 51.44,24.13 50.16,24.13 60.96,9.53 59.05,11.43 41.91,6.35 1.27,6.35 1.27,2.54 60.96,11.43 26.04,3.94 23.5,3.81 44.45,18.8 44.45,17.65 44.45,16.51 44.45,15.24 44.45,13.97 44.45,12.7 44.45,11.43 44.45,9.91 44.45,8.26 44.45,6.35 59.05,9.53 57.15,9.53 57.15,7.62 59.05,7.62 60.96,7.62 55.24,24.13 56.52,24.13 57.78,24.13
  pour Top (isolate 0.254): -11.81,54.1 -9.27,54.1 -9.27,52.83 -11.81,52.83
  pour Top (isolate 0.254, rank 6): 0,53.34 68.58,53.34 68.58,0 0,0
  pour Bottom (isolate 0.254, rank 6): 0,53.34 68.58,53.34 68.58,0 0,0
GPIO1  (via drill 0.3 pad 0.64)
  Top 0.254: U2.40 23.57,35.38 23.88,35.69 27.81,35.69 v29.21,34.29
  Bottom 0.254: J3.1 58.67,45.34 58.67,43.69 56.88,41.9 56.88,32.98 55.22,31.31 49.97,31.31 46.99,34.29 v29.21,34.29
GPIO2  (via drill 0.3 pad 0.64)
  Top 0.254: U2.41 23.46,34.38 24.26,35.18 27.05,35.18 v28.57,33.66
  Bottom 0.254: J3.2 57.4,41.53 57.4,32.64 55.56,30.8 49.78,30.8 46.93,33.66 v28.57,33.66
GPIO3  (via drill 0.3 pad 0.64)
  Top 0.254: U2.42 23.38,33.38 24.45,32.32 26.92,32.32 27.62,33.02 v29.21,33.02
  Bottom 0.254: J3.3 57.91,39.5 57.91,32.38 55.82,30.29 49.59,30.29 46.86,33.02 v29.21,33.02
GPIO4  (via drill 0.3 pad 0.64)
  Top 0.254: U2.43 23.56,32.38 24.13,31.81 27.18,31.81 27.75,32.38 v28.57,32.38
  Bottom 0.254: J3.4 58.42,37.47 58.42,32.13 56.13,29.84 49.34,29.84 46.8,32.38 v28.57,32.38
GPIO5  (via drill 0.3 pad 0.64)
  Top 0.254: U2.44 22.05,31.37 27.5,31.37 27.88,31.75 v29.21,31.75
  Bottom 0.254: J3.5 58.93,35.43 58.93,31.88 56.39,29.34 49.15,29.34 46.74,31.75 v29.21,31.75
GPIO6  (via drill 0.3 pad 0.64)
  Top 0.254: U2.47 25.84,28.39 v28.57,31.11
  Bottom 0.254: J3.6 60.33,32.51 56.64,28.83 48.9,28.83 46.61,31.11 v28.57,31.11
HRXD  (via drill 0.3 pad 0.64)
  Top 0.254: Q6.3 51.18,35.81 52.07,36.7 55.1,36.7 v55.3,36.9 55.56,36.64 R8.1
  Bottom 0.254: J7.2 55.3,45.66 v55.3,36.9
HTXD  (via drill 0.3 pad 0.64)
  Top 0.254: Q7.3 v54.36,35.81 54.86,35.31 R8.2
  Bottom 0.254: J7.5 54.74,43.69 54.74,37.34 54.36,36.96 v54.36,35.81
LDTR  (via drill 0.3 pad 0.64)
  Top 0.203: U2.3 46.83,26.39 46.86,26.42 47.45,26.42 48.13,27.1 48.13,28.45 49.02,29.34 59.05,29.34 59.69,28.7 59.69,24.38 v59.44,24.13
  Bottom 0.305: v59.44,24.13 59.44,23.75 J4.6
LINEIN_L
  Top 0.254: U2.24 36.04,43.09 36.83,42.29 42.42,42.29 43.77,43.65 49.57,43.65 50.55,42.67 54.23,42.67 55.12,41.78 55.12,41.02 C8.2
LINEIN_R
  Top 0.254: U2.23 37.04,43.1 37.34,42.8 42.29,42.8 43.66,44.16 49.81,44.16 50.8,43.18 54.61,43.18 56.13,41.66 56.13,40.01 55.24,39.12 C7.2
LRTS
  Top 0.203: U2.8 60.05,31.39 61.59,29.84 61.59,22.68 62.05,22.23 J4.5
LRXD
  Top 0.254: 50.55,33.85 Q6.2 50.48,34.49 50.48,34.6 | U2.10 47.23,33.38 47.62,33.78 47.62,34.51 47.91,34.8 50.29,34.8 | 50.29,34.8 50.55,34.8 | 50.55,34.8 50.67,34.8 | 50.67,34.8 54.61,34.8 54.86,34.54 R8.3 | 50.48,34.61 50.48,34.73 50.55,34.8 | 50.48,34.6 50.48,34.61 | 50.48,34.61 50.29,34.8 | 50.48,34.6 50.67,34.8
LTXD
  Top 0.254: R8.4 53.96,33.73 Q7.2 53.85,33.72 53.85,32.64 53.09,31.88 47.88,31.88 47.37,32.38 U2.9
MRXD
  Top 0.254: J7.1 57.15,46.99 U3.2
MTXD
  Top 0.254: U3.1 61.59,48.9 59.82,48.9 58.17,47.24 58.17,46.1 J7.6
N$1
  Top 0.406: U2.60 R10.2 C10.2
N$2  (via drill 0.3 pad 0.64)
  Top 0.406: v48.26,18.41 50.04,16.64 Q5.3 50.8,16.76 50.93,16.89
  Top 1.27: 51.56,16.89 50.93,16.89 51.56,17.53 | 51.56,16.89 52.2,16.89 | 52.2,16.89 53.29,16.89 D2.+ | R23.1 51.56,17.78 51.56,17.53 | 51.56,17.53 51.56,16.89 | 51.56,17.53 52.2,16.89
  Bottom 0.406: v48.26,18.41 42.67,24 22.48,24 21.59,23.11 T_5V.T
N$3
  Top 0.305: Q3.3 6.73,3.56 R20.2
N$4  (via drill 0.3 pad 0.64)
  Top 0.406: R19.2 v51.82,37.47 | v42.35,27.05 42.35,35.56 v42.42,35.62
  Bottom 0.406: v51.82,37.47 51.82,36.83 51.18,36.2 42.99,36.2 v42.42,35.62 | v42.35,27.05 44.51,27.05 49.78,21.78 49.78,17.59 48.64,16.45 SIMHOLDER.4
N$5  (via drill 0.3 pad 0.64)
  Top 0.406: R18.1 v50.16,37.47
  Bottom 0.254: SIMHOLDER.3 48.56,38.56 49.66,37.47 v50.16,37.47
N$6  (via drill 0.3 pad 0.64)
  Top 0.406: R17.1 48.39,37.59 v48.51,37.47
  Bottom 0.254: SIMHOLDER.2 51.01,37.17 50.67,36.83 49.15,36.83 v48.51,37.47
N$7
  Top 0.305: R20.1 D3/NET.-
N$8
  Top 0.305: Q3.1 10.35,5.02 R15.1 R13.2
N$9
  Top 0.305: PWR.- R1.2
N$10  (via drill 0.3 pad 0.64)
  Top 0.305: R13.1 v12.32,7.62 | v24.13,20.32 25.97,20.32 U2.52
  Bottom 0.305: v12.32,7.62 23.23,7.62 24.13,8.52 v24.13,20.32
N$11  (via drill 0.3 pad 0.64)
  Top 0.305: v25.91,22.54 25.91,24 29.87,27.96 37.44,27.96 40.02,25.39 U2.2 | POWER.1 19.43,2.92 22.23,5.71 23.88,5.71 v24.89,6.73
  Bottom 0.305: v25.91,22.54 25.91,7.75 v24.89,6.73
N$12
  Top 0.254: R4.1 3.94,22.54 5.46,24.07 8.95,24.07 9.27,24.38 U1.7
N$13  (via drill 0.3 pad 0.64)
  Top 0.305: R12.1 C12.1 v18.67,31.37
  Top 0.61: U2.19 41.04,45.83 v41.02,45.85
  Bottom 0.305: v41.02,45.85 41.02,37.21 38.73,34.92 22.23,34.92 v18.67,31.37
N$15
  Top 0.305: L3.1 C13.1 C18.2 C14.2 | C14.2 C17.1 | C14.2 19.18,37.08 19.68,37.08 19.94,37.34 19.94,46.23 22.99,49.28 36.7,49.28 38.73,47.24 38.73,45.97 39.04,45.67 U2.21
N$16
  Top 0.254: Q4.3 14.22,3.94 R21.2
N$17
  Top 0.305: D2/STA.- R21.1
N$18
  Top 0.254: R14.2 R16.1 16.26,5.21 Q4.1
N$19
  Top 0.254: C14.1 18.8,36.07
  Top 0.305: L1.1 C19.2 C18.1 C14.1 C15.2 | 18.8,36.07 18.8,36.2 19.18,36.58 19.94,36.58 20.45,37.08 20.45,45.97 23.24,48.77 36.45,48.77 38.23,46.99 38.23,45.97 38.04,45.78 U2.22
N$20  (via drill 0.3 pad 0.64)
  Top 0.305: R14.1 v20.83,6.73 | U2.66 40.04,23.15 36.39,26.8 30.86,26.8 27.81,23.75 v27.81,22.54
  Bottom 0.305: v20.83,6.73 23.72,6.73 24.89,7.9 24.89,22.86 25.27,23.24 27.56,23.24 27.81,22.99 v27.81,22.54
N$21
  Top 0.406: C11.2 R10.1 R11.2 ANT1.D
N$23
  Top 0.254: C7.1 57.02,38.99 58.8,40.77 58.8,42.66 59.33,43.18 63.5,43.18 64.14,43.81 64.14,45.72 J13.6
N$29
  Top 0.254: C8.1 57.02,41.02 58.29,42.29 58.29,44.7 59.31,45.72 61.59,45.72 J13.5
N$30
  Top 0.305: L4.1 C16.2 R12.2
N$31
  Top 0.406: R22.1 48.58,15.88 Q5.1
N$36
  Top 0.406: R3.2 R2.1 51.75,28.19 Q1.1
N$38
  pour Top (isolate 0.254, rank 2, no thermals): 10.29,20.83 11.05,20.83 11.05,17.91 arc90 11.43,17.53 11.94,17.53 arc-90 12.32,17.14 12.32,9.22 arc-91 11.93,8.84 9.83,8.88 arc-89 9.46,9.26 9.46,17.14 arc-90 9.84,17.53 9.91,17.53 arc90 10.29,17.91
N$39
  Top 0.406: C22.1 49.4,12.19 R24.1 R22.2 46.74,14.35 46.35,13.97 D4.2
N$45
  Top 0.305: 13.97,30.23 L4.2 12.54,28.67 5.98,28.67 D7.2 4.63,29.84 2.8,31.67 J2.1
N$47
  Top 0.305: U1.5 11.81,23.75 12.32,23.24 R5.1 R6.1 C1.2
N$48
  Top 0.305: D5.2 9.4,43.81 8.9,43.32 J2.4 8.9,38.73 9.4,38.23 13.34,38.23 13.72,38.61 13.72,40.26 14.22,40.77 L3.2
N$51
  Top 0.305: D6.2 9.27,29.84 8.6,30.52 J2.3 8.6,34.89 9.14,35.43 13.21,35.43 13.72,34.92 13.72,33.53 14.35,32.89 L1.2
N$52
  Top 0.406: R11.1 38.1,14.73 arc-90 39.37,13.46 P1.1
PWM1  (via drill 0.3 pad 0.64)
  Top 0.254: v30.48,29.84 30.48,34.83 28.54,36.77 26.92,36.77 23.3,40.38 U2.35
  Bottom 0.254: 62.87,33.91 J13.1 62.87,33.53 57.09,27.75 48.39,27.75 46.29,29.84 v30.48,29.84
PWM2  (via drill 0.3 pad 0.64)
  Top 0.254: v29.84,30.48 29.84,34.63 28.28,36.2 26.67,36.2 23.48,39.38 U2.36
  Bottom 0.254: J13.2 61.59,35.56 61.59,33.02 56.9,28.32 48.64,28.32 46.48,30.48 v29.84,30.48
PWRKEY  (via drill 0.3 pad 0.64)
  Top 0.305: v26.86,22.54 26.86,23.88 30.35,27.36 36.77,27.36 39.75,24.39 U2.1 | POWER.2 21.84,4.38 22.54,5.08 24.38,5.08 v25.91,6.6
  Top 0.406: U2.1 47.24,24.39 49.15,26.29 Q1.3
  Bottom 0.305: v26.86,22.54 26.86,7.56 v25.91,6.6
RI
  Top 0.203: J4.1 64.32,12.88 62.15,12.88 61.34,13.69 61.34,20.83 60.07,22.1 60.07,28.95 59.17,29.84 48.9,29.84 47.62,28.57 47.62,27.69 47.32,27.39 U2.4
SIM_CLK
  Top 0.254: U2.32 28.04,42.6 30.36,40.28 42.95,40.28 44.33,41.67 48.63,41.67 R18.2 49.91,40.13
SIM_DATA
  Top 0.254: U2.31 29.04,42.34 30.61,40.77 42.8,40.77 44.2,42.16 48.77,42.16 49.78,41.15 50.8,41.15 R19.1
SIM_RST
  Top 0.254: U2.33 27.04,42.82 30.09,39.77 43.07,39.77 44.45,41.15 48.13,41.15 48.39,40.89 R17.2
SIM_VDD  (via drill 0.3 pad 0.64)
  Top 0.254: U2.30 30.04,42.18 30.95,41.27 42.67,41.27 44.05,42.65 49.04,42.65 50.04,41.66 52.7,41.66 v53.34,41.02 C20.1
  Bottom 0.254: SIMHOLDER.1 53.61,40.75 v53.34,41.02
SRXD
  Top 0.254: J7.3 51.44,47.62 50.8,48.26 44.2,48.26 U3.9
STXD
  Top 0.254: U3.8 47.62,48.9 51.3,48.9 52.7,47.49 52.7,45.72 J7.4
VBAT  (via drill 0.3 pad 0.64)
  Top 0.254: D3/NET.+ v10.29,2.67 D2/STA.+ | v26.92,2.67 PWR.+
  Top 0.305: 24.64,16.13 24.13,16.64 20.32,16.64 C3.+ | 27.3,15.62 27.18,15.75 C5.2
  Top 0.406: L2.2 15.11,16.82 C1.1 R6.2 16.13,21.59 16.76,22.23 v16.76,22.86 | C5.2 27.81,15.75 28.32,15.24 28.32,15.11 | 28.32,15.11 28.32,13.72 26.92,12.32 v26.92,2.67 | 28.32,15.11 28.07,15.37 | 28.32,15.11 28.57,15.37
  Bottom 0.254: v10.29,2.67 v26.92,2.67
  Bottom 0.406: T_4.1V.T 16.13,21.59 16.76,22.23 v16.76,22.86
  pour Top (isolate 0.406, no thermals): 28.83,21.27 31.24,21.27 31.24,18.41 arc-90 28.07,15.24 18.67,15.24 arc90 18.03,14.61 arc-90 17.4,13.97 15.24,13.97 arc-90 14.86,14.35 14.86,17.4 arc-90 15.24,17.78 28.19,17.78 arc90 28.83,18.41
VDD_EXT  (via drill 0.3 pad 0.64)
  Top 0.406: Q6.1 48.58,32.95 48.9,32.64 v51.94,32.64 51.94,33.72 Q7.1 | U2.15 47.34,38.38 47.5,38.23 47.5,35.94 v48.01,35.43 | 56.5,33.94 56.72,33.73 R8.5 57.08,33.08 | R8.6 56.71,34.55 56.5,34.34 56.5,33.94 | v54.61,32.64 56.83,32.64 | 56.83,32.64 57.15,32.64 | 57.15,32.64 57.34,32.64 | 57.15,32.64 57.08,32.7 57.08,32.9 | 57.08,33.08 57.09,33.08 57.09,32.89 56.83,32.64 | 57.08,33.08 57.08,32.9 | 57.08,32.9 57.34,32.64 | 56.5,33.94 | 57.34,32.64 60.07,32.64 v61.59,31.11
  Bottom 0.406: v48.01,35.43 50.8,32.64 v51.94,32.64 v54.61,32.64 | v61.59,31.11 61.59,24.69 62.41,23.88 63.88,23.88 64.77,22.99 64.77,18.41 J4.7
VIN  (via drill 0.64 pad 1.78)
  Top 0.406: C24.2 R4.2
  Top 1.778: C2.+ 6.22,14.73
  Top 2.032: v47.88,21.46 57.4,21.46 58.6,20.27 D2.- D1.- | D1.- 58.6,13.13 58.55,13.08 58.55,13.66 D1.- | 6.22,14.73 v6.22,12.83
  Bottom 0.406: T_EXT.T 18.41,24.38 | 18.41,24.38 18.41,25.22 18.67,25.48 | 18.41,24.38 17.91,24.89 | 18.41,24.38 18.8,24.77
  Bottom 2.032: v47.88,21.46 43.87,25.48 18.67,25.48 10.56,25.48 arc90 6.22,21.14 v6.22,12.83
  pour Top (isolate 0.254, no thermals): 9.02,20.83 9.78,20.83 9.78,18.62 arc-90 9.32,18.16 arc90 8.83,17.67 8.83,14.48 arc-90 8.19,13.84 5.08,13.84 arc-90 4.95,13.97 4.95,18.29 arc-90 5.59,18.92 8.49,18.92 arc90 9.02,19.45
VRTC  (via drill 0.38 pad 0.81)
  Top 0.61: U2.26 34.04,46.86 C6.2
  Top 1.016: v32.38,46.99 C6.2
  Bottom 1.016: J1.+ 30.93,45.54 v32.38,46.99

### Text on the board
tPlace: J5 | J6 | 1 | GPRS | SWserial | (L R)LNIn | HWserial | GND | GPIO | ADC | PWM2 | 6 | PWM1 | ISP | LRTS | CTS | LDTR | DSR | VCC | DCD | RI | GND | J8 | J9
bPlace: 1 | 1 | 1 | 1 | 9 | 8 | 7 | 6 | 5 | 4 | 3 | 2 | 1 | 0 | AREF | GND | 3 | 2 | 1 | 0 | FW_Update | GPRS Shield | v2.0b 11/6/2012 | by Seeed Studio | www.seeedstudio.com | SIMHOLDER | SIM Card Holder | ANALOG | RST | 3V3 | 5V | GND | GND | VIN | 0 | 1 | 2 | 3 | 4 | 5